# Altium project Board4_Sensor_Shield_UNO.PrjPcb
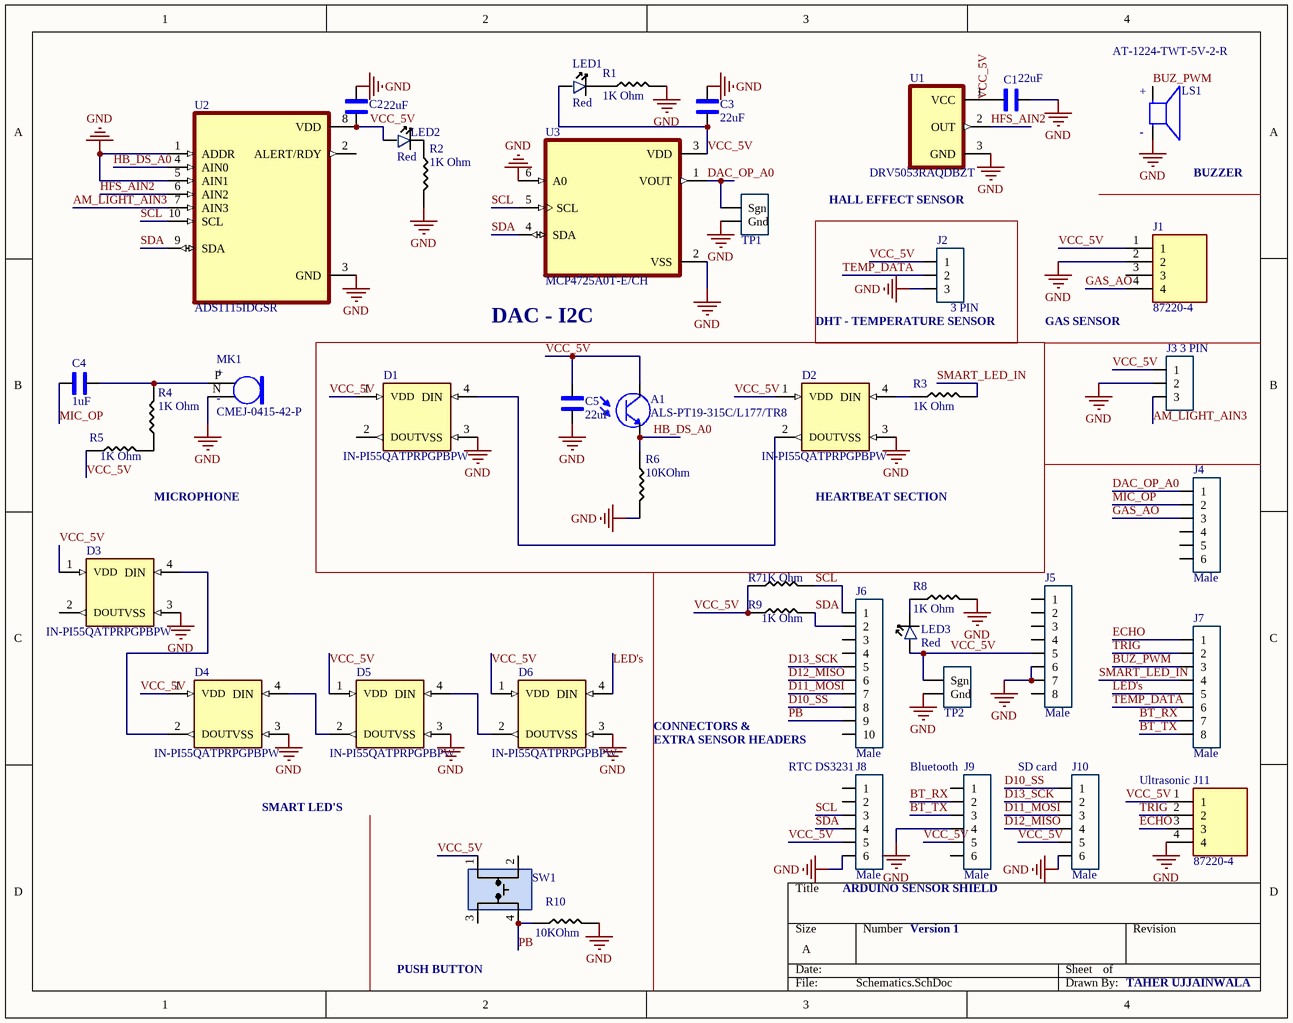
[diagram p0: Schematics.SchDoc]
1 sheet, 44 parts. Net scope: global (net labels, ports and power ports of the same name join across sheets).
Board file: Layout.PcbDoc

## Sheet Schematics.SchDoc
size A; SheetNumber: 1; SheetTotal: 1

### Parts
A1  ALS-PT19-315C/L177/TR8  [XDCR_ALS-PT19-315C/L177/TR8]
C1  22uF  [1206_Passive_Capacitor]
C2  22uF  [1206_Passive_Capacitor]
C3  22uF  [1206_Passive_Capacitor]
C4  1uF  [1206_Passive_Capacitor]
C5  22uF  [1206_Passive_Capacitor]
D1  IN-PI55QATPRPGPBPW  [SERIAL_LED]
D2  IN-PI55QATPRPGPBPW  [SERIAL_LED]
D3  IN-PI55QATPRPGPBPW  [SERIAL_LED]
D4  IN-PI55QATPRPGPBPW  [SERIAL_LED]
D5  IN-PI55QATPRPGPBPW  [SERIAL_LED]
D6  IN-PI55QATPRPGPBPW  [SERIAL_LED]
J1  87220-4  [TE_87220-4]
J2  3 PIN  [3_PIN_100mil]
J3  3 PIN  [3_PIN_100mil]
J4  value Male  [6_PIN_ARDUINO_100mil]  (hidden comment: PPTC061LFBN-RC)
J5  value Male  [8_PIN_ARDUINO_100MIL]  (hidden comment: PPTC081LFBN-RC)
J6  value Male  [10_PIN_ARDUINO_100MIL]  (hidden comment: PPTC101LFBN-RC)
J7  value Male  [8_PIN_ARDUINO_100MIL]  (hidden comment: PPTC081LFBN-RC)
J8  value Male  [6_PIN_ARDUINO_100mil]  (hidden comment: PPTC061LFBN-RC)
J9  value Male  [6_PIN_ARDUINO_100mil]  (hidden comment: PPTC061LFBN-RC)
J10  value Male  [6_PIN_ARDUINO_100mil]  (hidden comment: PPTC061LFBN-RC)
J11  87220-4  [TE_87220-4]
LED1  value Red  [LED]  (hidden comment: LTST-C150CKT)
LED2  value Red  [LED]  (hidden comment: LTST-C150CKT)
LED3  value Red  [LED]  (hidden comment: LTST-C150CKT)
LS1  AT-1224-TWT-5V-2-R  [XDCR_AT-1224-TWT-5V-2-R]
MK1  CMEJ-0415-42-P  [MIC_CMEJ-0415-42-P]
R1  value 1K Ohm  [1206_Passive_Resitor]  (hidden comment: 1k)
R2  value 1K Ohm  [1206_Passive_Resitor]  (hidden comment: 1k)
R3  value 1K Ohm  [1206_Passive_Resitor]  (hidden comment: 1k)
R4  value 1K Ohm  [1206_Passive_Resitor]  (hidden comment: 1k)
R5  value 1K Ohm  [1206_Passive_Resitor]  (hidden comment: 1k)
R6  value 10KOhm  [1206_Passive_Resitor]  (hidden comment: 10k)
R7  value 1K Ohm  [1206_Passive_Resitor]  (hidden comment: 1k)
R8  value 1K Ohm  [1206_Passive_Resitor]  (hidden comment: 1k)
R9  value 1K Ohm  [1206_Passive_Resitor]  (hidden comment: 1k)
R10  value 10KOhm  [1206_Passive_Resitor]  (hidden comment: 10k)
SW1  TL3305AF160QG  [Switch_JLC]  (value not drawn)
TP1  10x Probe TP  [TP10x_Probe]  (value not drawn)
TP2  10x Probe TP  [TP10x_Probe]  (value not drawn)
U1  DRV5053RAQDBZT  [SOT95P237X112-3N]
U2  ADS1115IDGSR  [SOP50P490X110-10N]
U3  MCP4725A0T-E/CH  [SOT95P270X145-6N]

### Blocks framed on the sheet
DAC - I2C: A1 C5 D1 D2 R3 R6

### Nets
GND: C1.2 C2.2 C3.2 C5.1 D1.3(VSS) D2.3(VSS) D3.3(VSS) D4.3(VSS) D5.3(VSS) D6.3(VSS) J1.2 J2.3 J3.2 J5.6 J5.7 J8.6 J9.4 J10.6 J11.4 LS1.N MK1.N(GND) R1.2 R2.2 R6.2 R8.2 R10.2 TP1.2(Gnd) TP2.2(Gnd) U1.3(GND) U2.1(ADDR) U2.3(GND) U2.5(AIN1) U3.2(VSS) U3.6(A0)
AM_LIGHT_AIN3: J3.3 U2.7(AIN3)
BT_RX: J7.7 J9.2
BT_TX: J7.8 J9.3
BUZ_PWM: J7.3 LS1.P
D10_SS: J6.8 J10.1
D11_MOSI: J6.7 J10.3
D12_MISO: J6.6 J10.4
D13_SCK: J6.5 J10.2
DAC_OP_A0: J4.1 TP1.1(Sgn) U3.1(VOUT)
ECHO: J7.1 J11.3
GAS_AO: J1.4 J4.3
HB_DS_A0: A1.2(E) R6.1 U2.4(AIN0)
HFS_AIN2: U1.2(OUT) U2.6(AIN2)
LED's: D6.4(DIN) J7.5
MIC_OP: C4.1 J4.2
PB: J6.9 R10.1 SW1.4
SCL: J6.1 J8.3 R7.2 U2.10(SCL) U3.5(SCL)
SDA: J6.2 J8.4 R9.2 U2.9(SDA) U3.4(SDA)
SMART_LED_IN: J7.4 R3.2
TEMP_DATA: J2.2 J7.6
TRIG: J7.2 J11.2
VCC_5V: A1.1(C) C1.1 C2.1 C3.1 C5.2 D1.1(VDD) D2.1(VDD) D3.1(VDD) D4.1(VDD) D5.1(VDD) D6.1(VDD) J1.1 J2.1 J3.1 J5.5 J8.5 J9.5 J10.5 J11.1 LED1.2 LED2.2 LED3.2 R5.1 R7.1 R9.1 SW1.1 TP2.1(Sgn) U1.1(VCC) U2.8(VDD) U3.3(VDD)
NetC4_2: C4.2 MK1.P(OUTPUT) R4.2
NetD1_4: D1.4(DIN) D2.2(DOUT)
NetD2_4: D2.4(DIN) R3.1
NetD3_4: D3.4(DIN) D4.2(DOUT)
NetD4_4: D4.4(DIN) D5.2(DOUT)
NetD5_4: D5.4(DIN) D6.2(DOUT)
NetLED1_1: LED1.1 R1.1
NetLED2_1: LED2.1 R2.1
NetLED3_1: LED3.1 R8.1
NetR4_1: R4.1 R5.2

Not connected (* = marked no-connect by the designer): D1 2(DOUT); D3 2(DOUT); J1 3; J4 4 5 6; J5 1 2 3 4 8; J6 3 4 10; J8 1 2; J9 1 6; SW1 2 3; U2 2(ALERT/RDY)

### Notes on the sheet
- HALL EFFECT SENSOR
- BUZZER
- (near J2) DHT - TEMPERATURE SENSOR
- GAS SENSOR
- MICROPHONE
- HEARTBEAT SECTION
- CONNECTORS &
- EXTRA SENSOR HEADERS
- (near J8) RTC DS3231
- (near J9) Bluetooth
- (near J10) SD card
- SMART LED'S
- (near J11) Ultrasonic
- ARDUINO SENSOR SHIELD
- PUSH BUTTON
- Version 1
- TAHER UJJAINWALA
- (in symbol AT-1224-TWT-5V-2-R) +; -
- (in symbol CMEJ-0415-42-P) +; -

### Library data of the parts
A1 = ALS-PT19-315C/L177/TR8: Phototransistors 630nm 2-SMD, No Lead; MF: Everlight; Availability: Good; Check_prices: https://www.snapeda.com/parts/ALS-PT19-315C/L177/TR8/Everlight%20Electronics%20Co%20Ltd/view-part/226235/?ref=eda; SnapEDA_Link: https://www.snapeda.com/parts/ALS-PT19-315C/L177/TR8/Everlight%20Electronics%20Co%20Ltd/view-part/226235/?ref=snap; MP: ALS-PT19-315C/L177/TR8; Price: None; Purchase-URL: https://pricing.snapeda.com/search/part/ALS-PT19-315C/L177/TR8/?ref=eda; Package: None; Value: *
C1-C3 C5 = C_22uF_1206: 22µF ±20% 16V Ceramic Capacitor X5R 1206 (3216 Metric); MFR Part #: CL31A226KPHNNNE; Type: Extended; Digikey Link: https://www.digikey.com/product-detail/en/CL31A226MOCLNNC/1276-2728-1-ND/3890814/?itemSeq=304982363; Digikey Part: 1276-2728-1-ND; Value: 22uF
C4 = C_1uF_1206: 1µF ±20% 16V Ceramic Capacitor X7R 1206 (3216 Metric); MFR Part #: CL31B105KBHNNNE; Type: Basic; Digikey Link: https://www.digikey.com/product-detail/en/C1206C105M4RACTU/399-8150-1-ND/3471873/?itemSeq=304982366; Digikey Part: 399-8150-1-ND; Value: 1uF
D1-D6 = LED_Smart_5050: Digital Series Cascade LED; DigiKey: https://www.digikey.com/product-detail/en/inolux/IN-PI55QATPRPGPBPW-60/1830-1209-1-ND/9681289; Parameter 1: *
J1 J11 = 87220-4: Conn Unshrouded Header HDR 4 POS 2.54mm Solder ST Thru-Hole Carton; MF: TE Connectivity; Centerline_Pitch: 2.54 mm[.1 in]; Product_Type: Connector; Number_of_Positions: 4; Check_prices: https://www.snapeda.com/parts/87220-4/TE%20Connectivity%20AMP%20Connectors/view-part/498541/?ref=eda; Availability: Warning; Value: *; EU_RoHS_Compliance: Compliant; Price: None; Package: None; MP: 87220-4; Purchase-URL: https://pricing.snapeda.com/search/part/87220-4/?ref=eda; SnapEDA_Link: https://www.snapeda.com/parts/87220-4/TE%20Connectivity%20AMP%20Connectors/view-part/498541/?ref=snap
J2 J3 = J_3_PIN_HEADER: 3 2.54mm Straight 1 Header，Breakaway Through Hole Pin Header & Female Header ROHS; MFR Part #: C49257; Type: Extended; Datasheet: https://datasheet.lcsc.com/lcsc/1811132313_BOOMELE-Boom-Precision-Elec-C49257_C49257.pdf; LCSC Part#: C49257; Value: 3 PIN
J4 J8-J10 = JM_6_PIN_MALE_ARDUINO: 6 Position Header Connector 0.100" (2.54mm) Through Hole Tin; Digikey Link: https://www.digikey.com/product-detail/en/PPTC061LFBN-RC/S7004-ND/810145/?itemSeq=304982353; Digikey Part: S7004-ND; LCSC Part#: DNP
J5 J7 = JM_8_PIN_MALE_ARDUINO: 8 Position Header Connector 0.100" (2.54mm) Through Hole Tin; Digikey Link: https://www.digikey.com/product-detail/en/PPTC081LFBN-RC/S7006-ND/810147/?itemSeq=304982354; Digikey Part: S7006-ND; LCSC Part#: DNP
J6 = JM_10_PIN_MALE_ARDUINO: 10 Position Header Connector 0.100" (2.54mm) Through Hole Tin; Digikey Link: https://www.digikey.com/product-detail/en/PPTC101LFBN-RC/S7008-ND/810149/?itemSeq=304982352; Digikey Part: S7008-ND; LCSC Part#: DNP
LED1-LED3 = LED_1206: Red 638nm LED Indication - Discrete 1.8V 1206 (3216 Metric); Digikey Link: https://www.digikey.com/product-detail/en/LTST-C150CKT/160-1167-1-ND/269239/?itemSeq=304982368; Digikey Part: 160-1167-1-ND
LS1 = AT-1224-TWT-5V-2-R: AUDIO TRANSDUCER 5 VP-P 87 DB 2400 HZ; MF: PUI Audio,; Check_prices: https://www.snapeda.com/parts/AT-1224-TWT-5V-2-R/PUI%20Audio,%20Inc./view-part/453710/?ref=eda; Purchase-URL: https://pricing.snapeda.com/search/part/AT-1224-TWT-5V-2-R/?ref=eda; SnapEDA_Link: https://www.snapeda.com/parts/AT-1224-TWT-5V-2-R/PUI%20Audio,%20Inc./view-part/453710/?ref=snap; Value: *; MP: AT-1224-TWT-5V-2-R; Package: PUI Audio,; Price: None; Availability: In Stock
MK1 = CMEJ-0415-42-P: 4.0 Ð¼Ð¼, Ð²ÑÐµÐ½Ð°Ð¿Ñ€Ð°Ð²Ð»ÐµÐ½Ð½Ñ‹Ð¹, Ð¼Ð¾Ð½Ñ‚Ð°Ð¶ Ð½Ð° Ð¿ÐµÑ‡Ð°Ñ‚Ð½Ð¾Ð¹ Ð¿Ð»Ð°Ñ‚Ðµ, 2.0 Ð’ Ð¿Ð¾ÑÑ‚Ð¾ÑÐ½Ð½Ð¾Ð³Ð¾ Ñ‚Ð¾ÐºÐ°, Ð­Ð»ÐµÐºÑ€ÐµÑ‚-ÐºÐ¾Ð½Ð´ÐµÐ½ÑÐ°Ñ‚Ð¾Ñ€Ð½Ñ‹Ð¹ Ð¼Ð¸ÐºÑ€Ð¾Ñ„Ð¾Ð½; MF: CUI Devices; Digi-Key_Part_Number: 102-6542-ND; Package: CUI Inc.; CUI_purchase_URL: https://www.cuidevices.com/product/audio/microphones/electret-condenser-microphones/cmej-0415-42-p?utm_source=snapeda.com&utm_medium=referral&utm_campaign=snapedaBOM; MP: CMEJ-0415-42-P; Digi-Key_Purchase_URL: https://www.digikey.com/product-detail/en/cui-devices/CMEJ-0415-42-P/102-6542-ND/10253451?utm_source=snapeda&utm_medium=aggregator&utm_campaign=symbol; SnapEDA_Link: https://www.snapeda.com/parts/CMEJ-0415-42-P/CUI%20Devices/view-part/3625885/?ref=snap; Value: *
R1-R5 R7-R9 = R_1K_1206: 1 kOhms ±1% 0.5W, 1/2W Chip Resistor 1206 (3216 Metric) Anti-Sulfur, Moisture Resistant Thin Film; MFR Part #: 1206W4F1001T5; Digikey Link: https://www.digikey.com/product-detail/en/RNCP1206FTD1K00/RNCP1206FTD1K00CT-ND/2240675/?itemSeq=304982373; Digikey Part: RNCP1206FTD1K00CT-ND
R6 R10 = R_10KOhm_1206: 10 kOhms ±5% 0.25W, 1/4W Chip Resistor 1206 (3216 Metric) Automotive AEC-Q200 Thick Film; Digikey Link: https://www.digikey.com/product-detail/en/RMCF1206JT300R/RMCF1206JT300RCT-ND/1942776/?itemSeq=304982374; Digikey Part: RMCF1206JT300RCT-ND
  R10: LCSC Part#: C17902; Type: Basic
SW1 = SW_Push_Button_JLC: Tactile Switch SPST-NO Top Actuated Surface Mount; MFR Part #: C174049; LCSC Part#: C174049; Type: Extended
TP1 TP2 = TP_10x_Probe: Test Point 300 mil centers
U1 = DRV5053RAQDBZT: SENSOR LINEAR ANALOG SOT23-3; Package: None; Price: None; Value: *; MP: DRV5053RAQDBZT; Availability: Unavailable
U2 = ADS1115IDGSR: 16-Bit 860SPS 4-Ch Delta-Sigma ADC With PGA, Oscillator, Vref, Comparator, and I2C 10-VSSOP -40 to 125; MF: Texas Instruments; SnapEDA_Link: https://www.snapeda.com/parts/ADS1115IDGSR/Texas%20Instruments/view-part/45903/?ref=snap; Value: *; Texas_Instruments-Purchase-URL: https://snapeda.com/shop?store=Texas+Instruments&id=45903; Price: None; Availability: Good; Mouser-Purchase-URL: https://snapeda.com/shop?store=Mouser&id=45903; MP: ADS1115IDGSR; Package: VSSOP-10 Texas Instruments; DigiKey-Purchase-URL: https://snapeda.com/shop?store=DigiKey&id=45903
U3 = MCP4725A0T-E/CH: 12 Bit Digital to Analog Converter 1 SOT-23-6; MF: Microchip; Package: SOT-23-6 Microchip; Value: *; Availability: Unavailable; SnapEDA_Link: https://www.snapeda.com/parts/MCP4725A0T-E/CH/Microchip/view-part/109888/?ref=snap; Price: None; MP: MCP4725A0T-E/CH